# Altium schematic sheet wiz810smj.SchDoc
size A
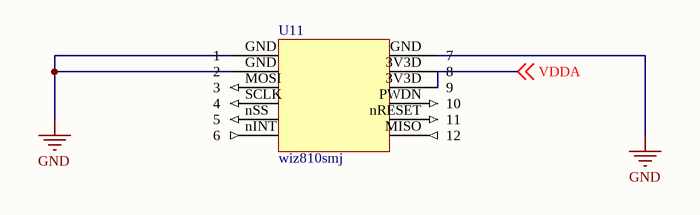
[diagram p0: wiz810smj.SchDoc]

## Parts
U11  wiz810smj

## Nets

Not connected (* = marked no-connect by the designer): U11 3V3D(9) GND(1) MISO(12) MOSI(3) nINT(6) nRESET(11) nSS(5) PWDN(10) SCLK(4)